# EAGLE schematic Kimera_core_v1.0 (EAGLE 7.3.0)
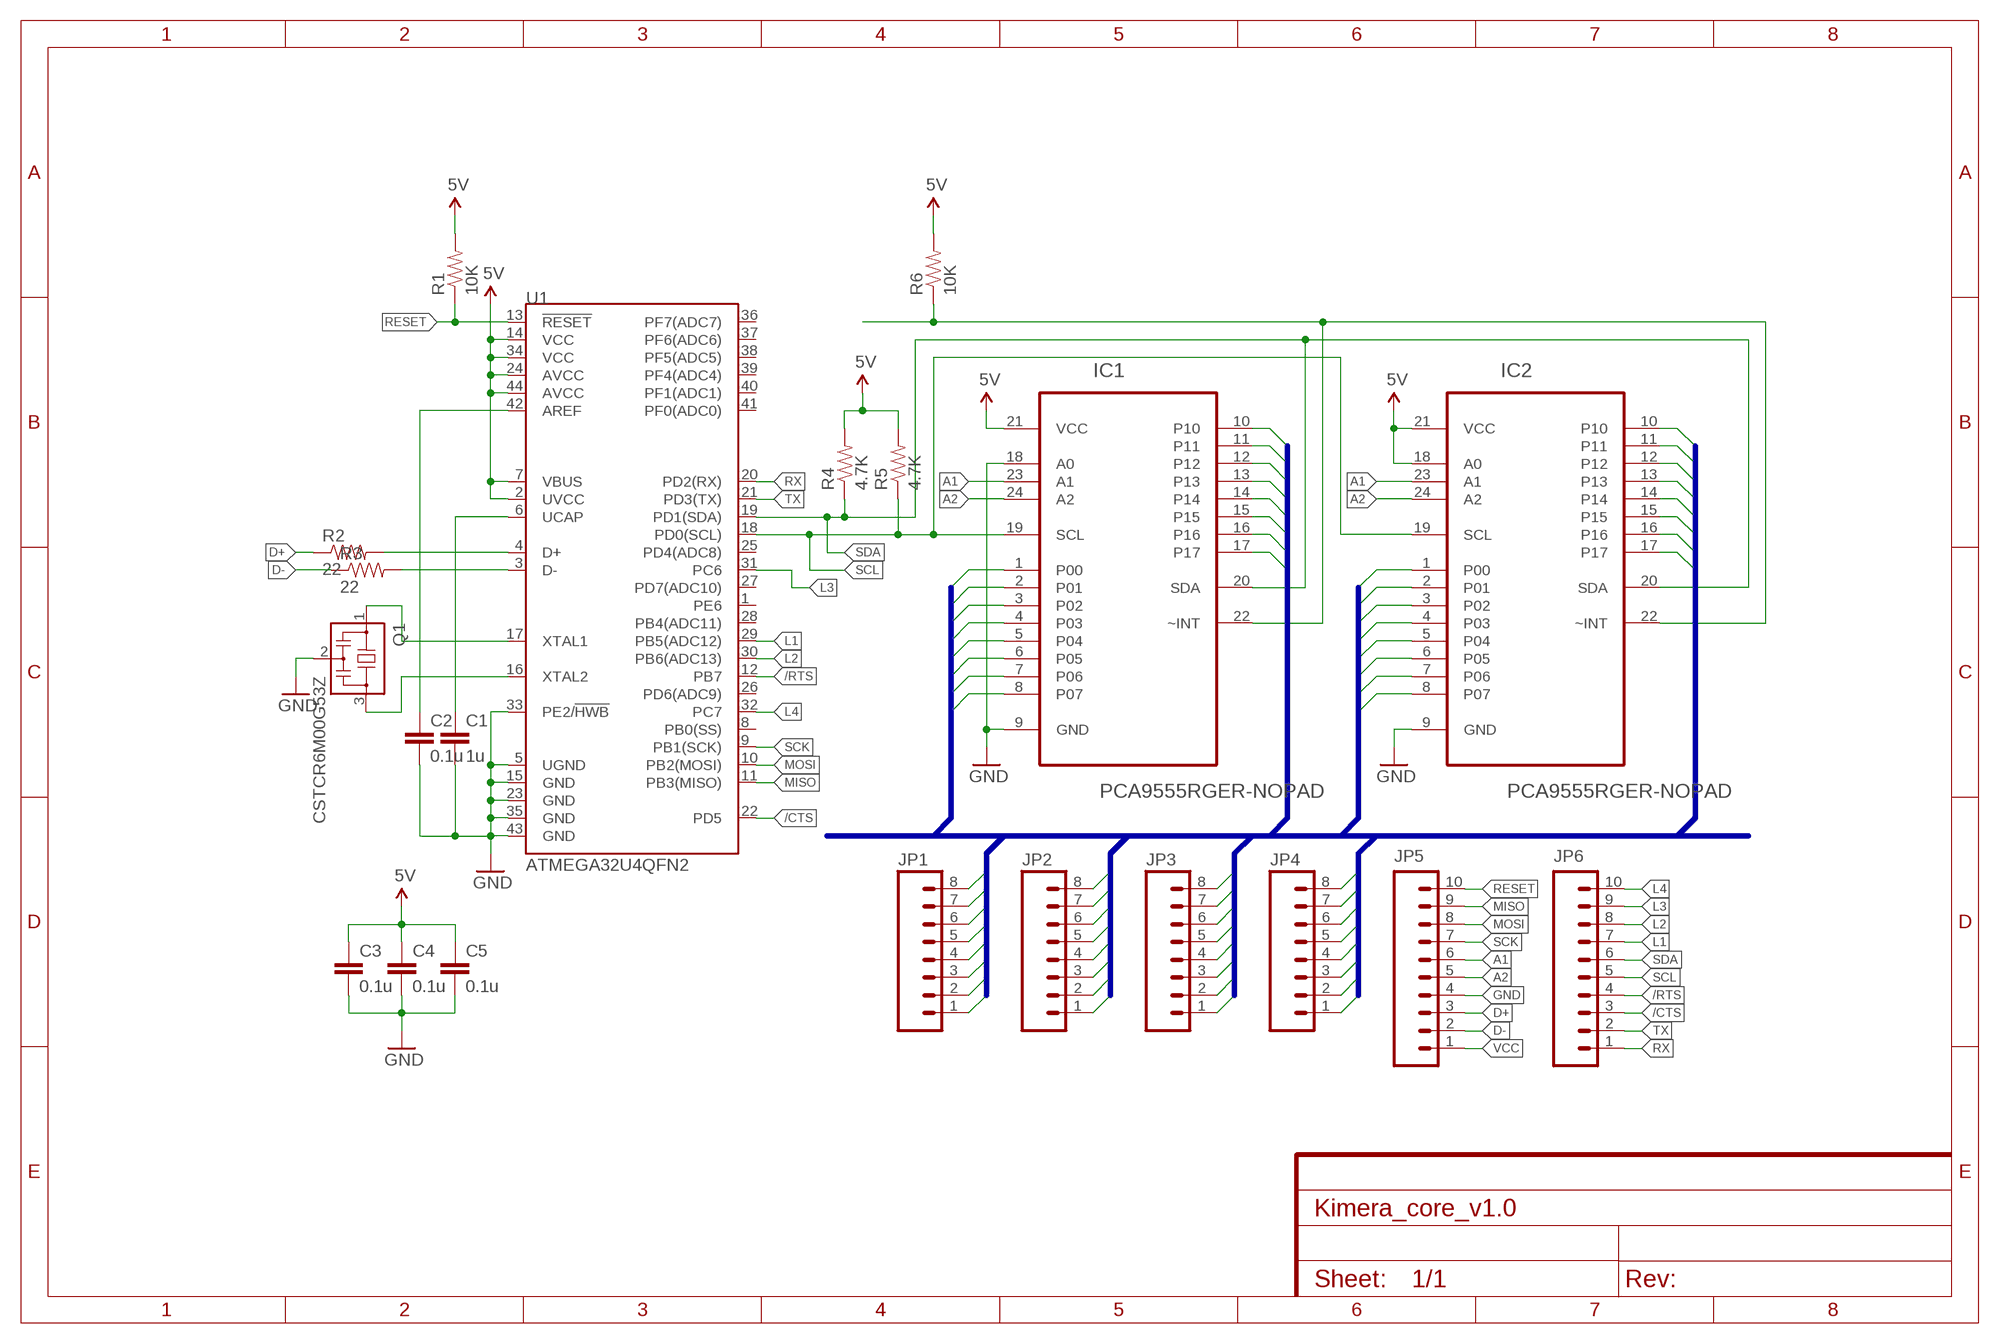
[diagram p0: schematic, sheet 1]
FRAME1 (FRAME-A4L): CNAME: Noukensha; CREVISION: 1.0; DESIGNER: Kai Ryu

## Parts
C1  1u  CAP0402-CAP  [0402-CAP]
C2  0.1u  CAP0402-CAP  [0402-CAP]
C3  0.1u  CAP0402-CAP  [0402-CAP]
C4  0.1u  CAP0402-CAP  [0402-CAP]
C5  0.1u  CAP0402-CAP  [0402-CAP]
IC1  PCA9555RGER-NOPAD  [QFN50P400X400X100-25N-NOPAD]
IC2  PCA9555RGER-NOPAD  [QFN50P400X400X100-25N-NOPAD]
JP1  P08  [P08]
JP2  P08  [P08]
JP3  P08  [P08]
JP4  P08  [P08]
JP5  P10  [P10]
JP6  P10  [P10]
Q1  CSTCR6M00G53Z  [CSTER12M]
R1  10K  RESISTOR0402-RES  [0402-RES]
R2  22  RESISTOR0402-RES  [0402-RES]
R3  22  RESISTOR0402-RES  [0402-RES]
R4  4.7K  RESISTOR0402-RES  [0402-RES]
R5  4.7K  RESISTOR0402-RES  [0402-RES]
R6  10K  RESISTOR0402-RES  [0402-RES]
U1  ATMEGA32U4QFN2  [QFN-44-NOPAD]

## Nets
/CTS: JP6.3 U1.22(PD5)
/RTS: JP6.4 U1.12(PB7)
A1: IC1.23(A1) IC2.23(A1) JP5.6
A2: IC1.24(A2) IC2.24(A2) JP5.5
D+: JP5.3 R2.1
D-: JP5.2 R3.1
GND: C1.2 C2.2 C3.2 C4.2 C5.2 IC1.9(GND) IC1.18(A0) IC2.9(GND) JP5.4 Q1.2 U1.5(UGND) U1.15(GND) U1.23(GND) U1.33(PE2/!HWB) U1.35(GND) U1.43(GND)
L1: JP6.7 U1.29(PB5(ADC12))
L2: JP6.8 U1.30(PB6(ADC13))
L3: JP6.9 U1.31(PC6)
L4: JP6.10 U1.32(PC7)
MISO: JP5.9 U1.11(PB3(MISO))
MOSI: JP5.8 U1.10(PB2(MOSI))
N$2: R2.2 U1.4(D+)
N$3: Q1.1 U1.17(XTAL1)
N$4: Q1.3 U1.16(XTAL2)
N$5: R3.2 U1.3(D-)
N$6: C1.1 U1.6(UCAP)
N$7: C2.1 U1.42(AREF)
N$12: IC1.22(~INT) IC2.22(~INT) R6.1
P1: IC1.1(P00) JP1.1
P2: IC1.2(P01) JP1.2
P3: IC1.3(P02) JP1.3
P4: IC1.4(P03) JP1.4
P5: IC1.5(P04) JP1.5
P6: IC1.6(P05) JP1.6
P7: IC1.7(P06) JP1.7
P8: IC1.8(P07) JP1.8
P9: IC1.10 JP2.1
P10: IC1.11 JP2.2
P11: IC1.12 JP2.3
P12: IC1.13 JP2.4
P13: IC1.14 JP2.5
P14: IC1.15 JP2.6
P15: IC1.16 JP2.7
P16: IC1.17 JP2.8
P17: IC2.1(P00) JP3.1
P18: IC2.2(P01) JP3.2
P19: IC2.3(P02) JP3.3
P20: IC2.4(P03) JP3.4
P21: IC2.5(P04) JP3.5
P22: IC2.6(P05) JP3.6
P23: IC2.7(P06) JP3.7
P24: IC2.8(P07) JP3.8
P25: IC2.10 JP4.1
P26: IC2.11 JP4.2
P27: IC2.12 JP4.3
P28: IC2.13 JP4.4
P29: IC2.14 JP4.5
P30: IC2.15 JP4.6
P31: IC2.16 JP4.7
P32: IC2.17 JP4.8
RESET: JP5.10 R1.1 U1.13(!RESET)
RX: JP6.1 U1.20(PD2(RX))
SCK: JP5.7 U1.9(PB1(SCK))
SCL: IC1.19(SCL) IC2.19(SCL) JP6.5 R5.1 U1.18(PD0(SCL))
SDA: IC1.20(SDA) IC2.20(SDA) JP6.6 R4.1 U1.19(PD1(SDA))
TX: JP6.2 U1.21(PD3(TX))
VCC: C3.1 C4.1 C5.1 IC1.21(VCC) IC2.18(A0) IC2.21(VCC) JP5.1 R1.2 R4.2 R5.2 R6.2 U1.2(UVCC) U1.7(VBUS) U1.14(VCC) U1.24(AVCC) U1.34(VCC) U1.44(AVCC) ; supply symbol labelled 5V
Unconnected: U1.1(PE6) U1.8(PB0(SS)) U1.25(PD4(ADC8)) U1.26(PD6(ADC9)) U1.27(PD7(ADC10)) U1.28(PB4(ADC11)) U1.36(PF7(ADC7)) U1.37(PF6(ADC6)) U1.38(PF5(ADC5)) U1.39(PF4(ADC4)) U1.40(PF1(ADC1)) U1.41(PF0(ADC0))

## Buses
P[1..32]

## Library data of the parts
C1-C5 = SparkFun-Passives:CAP: Capacitor Standard 0603 ceramic capacitor, and 0.1" leaded capacitor.
IC1 IC2 = pca9555:PCA9555RGER-NOPAD: 16-BIT I/O EXPANDER
JP1-JP4 = castellation:P08
JP5 JP6 = castellation:P10
Q1 = cstce-resonator:CSTCR: Resonator Source: murata.co.jp; MPN: CSTCC12M0; OC_FARNELL: 1170434; OC_NEWARK: 25M8759
R1-R6 = SparkFun-Passives:RESISTOR: Resistor Basic schematic elements and footprints for 0603, 1206, and PTH resistors.
U1 = SparkFun-DigitalIC:ATMEGA32U4: Atmel 44-pin 8-bit Microcontroller with 32KBytes of ISP Flash and USB Controller